# Altium schematic sheet LM7171SMD.SchDoc
size A4
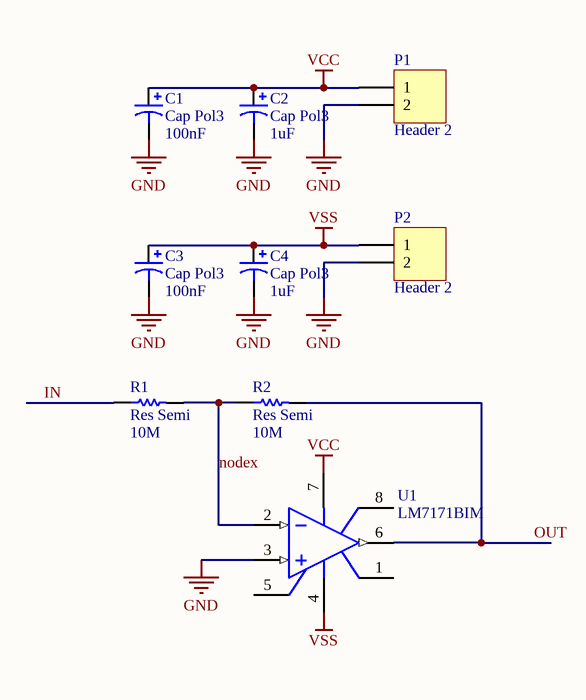
[diagram p0: LM7171SMD.SchDoc]

## Parts
C1  Cap Pol3  value 100nF  [C0805]
C2  Cap Pol3  value 1uF  [C0805]
C3  Cap Pol3  value 100nF  [C0805]
C4  Cap Pol3  value 1uF  [C0805]
P1  Header 2  [HDR1X2]
P2  Header 2  [HDR1X2]
R1  Res Semi  value 10M  [2012[0805]]
R2  Res Semi  value 10M  [2012[0805]]
U1  LM7171BIM  [D008_M]

## Nets
GND: C1.2 C2.2 C3.2 C4.2 P1.2 P2.2 U1.3(IN+)
VCC: C1.1 C2.1 P1.1 U1.7(V+)
VSS: C3.1 C4.1 P2.1 U1.4(V-)
IN: R1.1
nodex: R1.2 R2.1 U1.2(IN-)
OUT: R2.2 U1.6(OUT)

Not connected (* = marked no-connect by the designer): U1 1(OS_TRIM) 5(OS_TRIM) 8(NC)

## Library data of the parts
C1-C4 = Cap Pol3: Polarized Capacitor (Surface Mount); Published: 8-Jun-2000; LatestRevisionDate: 17-Jul-2002; LatestRevisionNote: Re-released for DXP Platform.; PackageReference: C0805; Publisher: Altium Limited
P1 P2 = Header 2: Header, 2-Pin; LatestRevisionDate: 17-Jul-2002; LatestRevisionNote: Re-released for DXP Platform.; Publisher: Altium Limited
R1 R2 = Res Semi: Semiconductor Resistor; Published: 8-Jun-2000; LatestRevisionDate: 17-Jul-2002; LatestRevisionNote: Re-released for DXP Platform.; PackageReference: AXIAL-0.5; Publisher: Altium Limited
U1 = LF351D: Operational Amplifier; Note: Pin 8 is not connected; ComponentAvailability: Obsolete; Published: 16-Jan-2001; LatestRevisionDate: 13-Apr-2006; LatestRevisionNote: IPC-7351 Footprint Added.; DatasheetVersion: Aug-1994; PackageVersion: Jan-1998; PackageReference: D008; Publisher: Altium Limited; PackageDescription: 8-Pin Small Outline Integrated Circuit 1.27 mm Pitch; Code_IPC: SOIC127P600-8; ComponentLink1Description: Manufacturer Link; ComponentLink1URL: http://www.ti.com/; ComponentLink2Description: Datasheet; ComponentLink2URL: http://www-s.ti.com/sc/ds/lf351.pdf